# EAGLE schematic MCU (EAGLE 8.7.1)
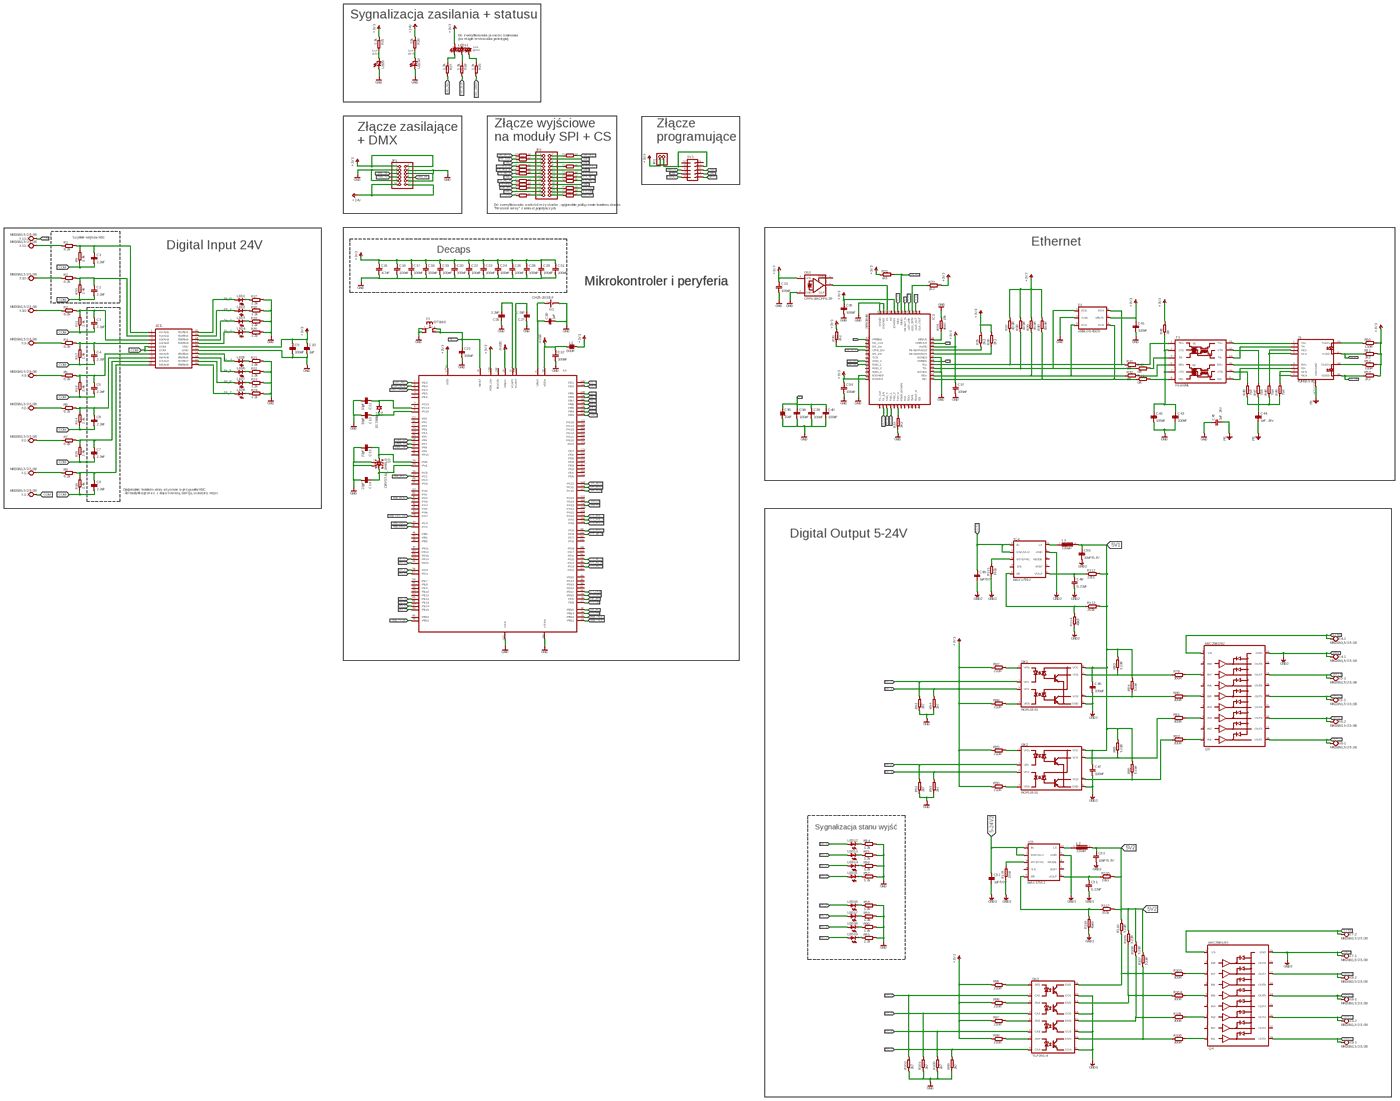
[diagram p0: schematic, sheet 1, overview]
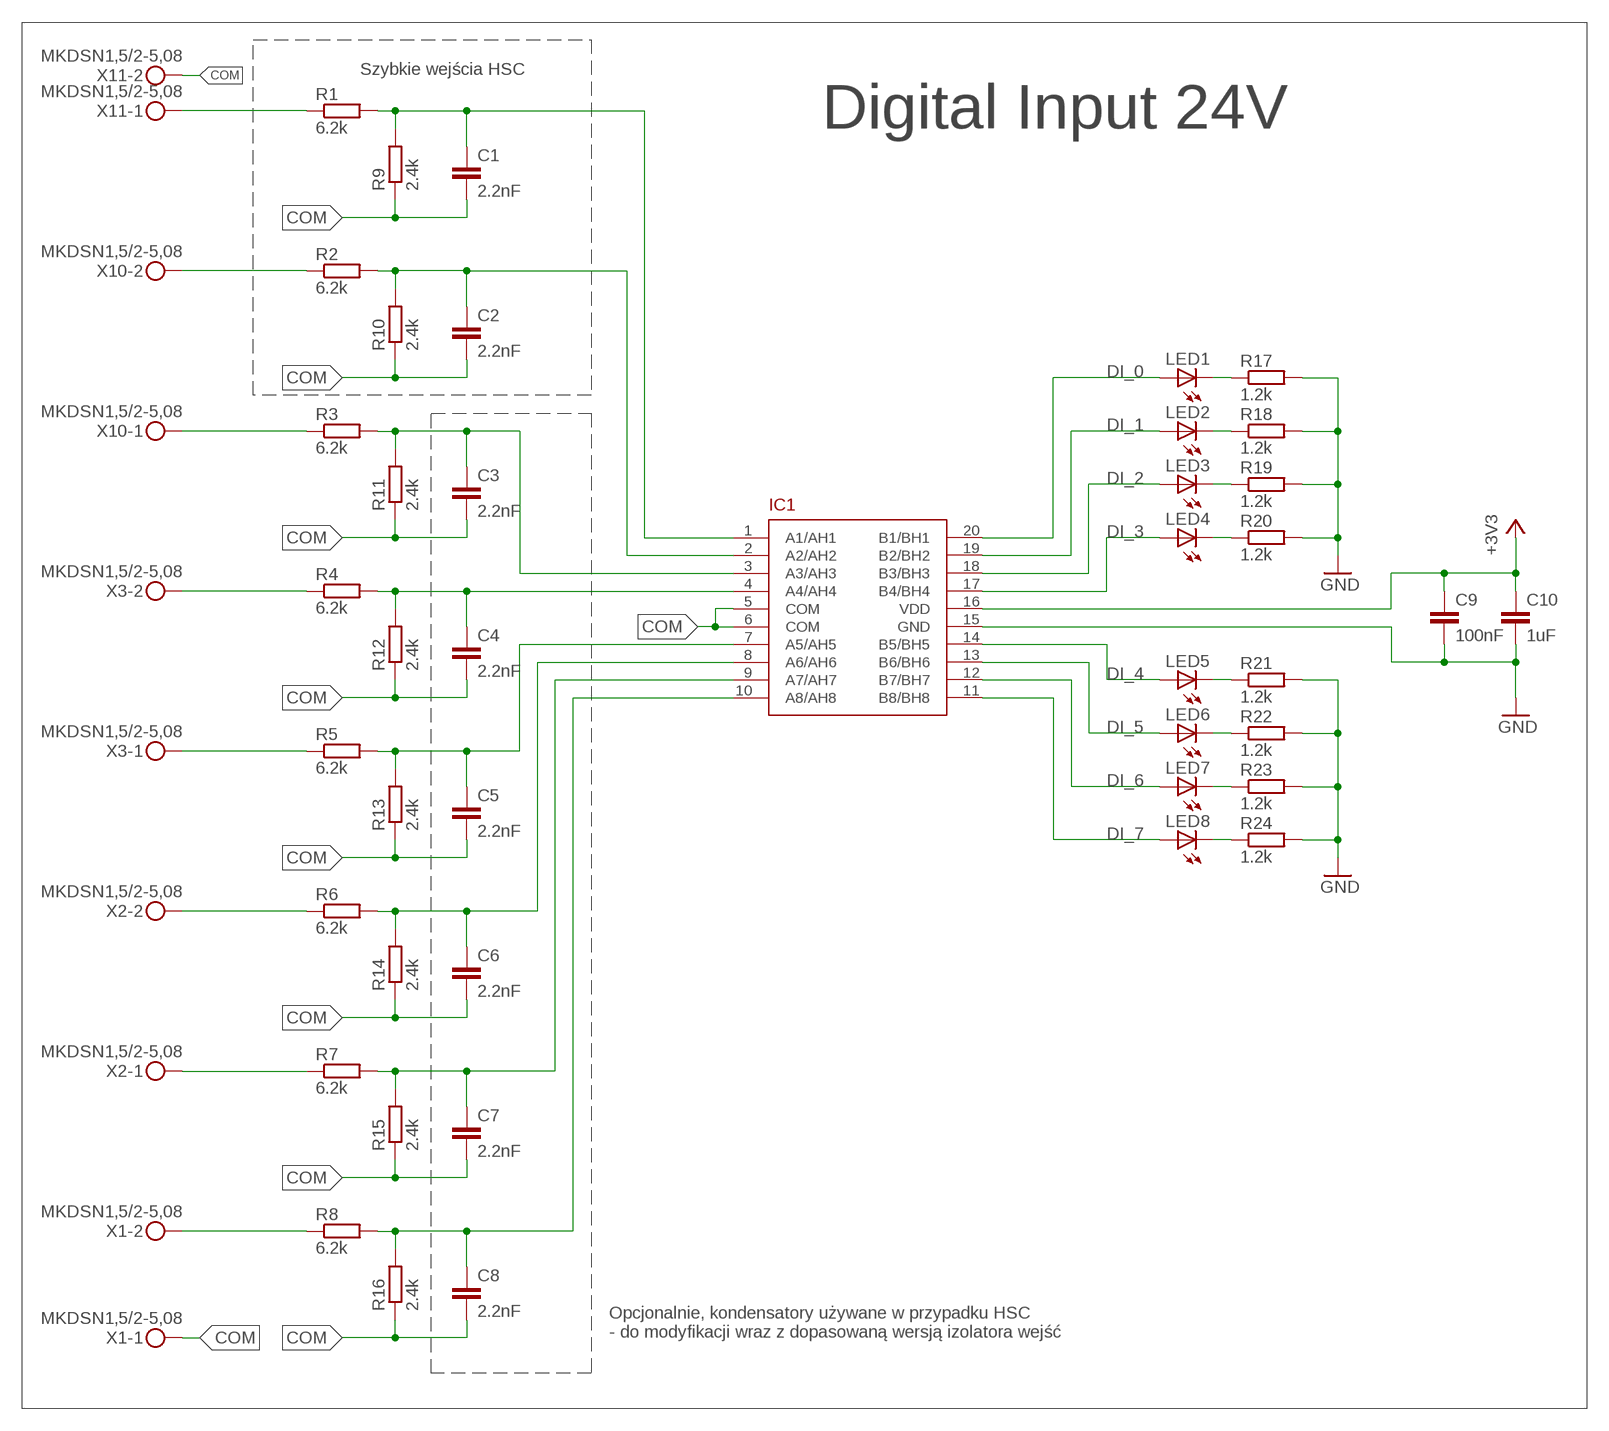
[diagram p1: schematic, sheet 1, part 1 of 5]
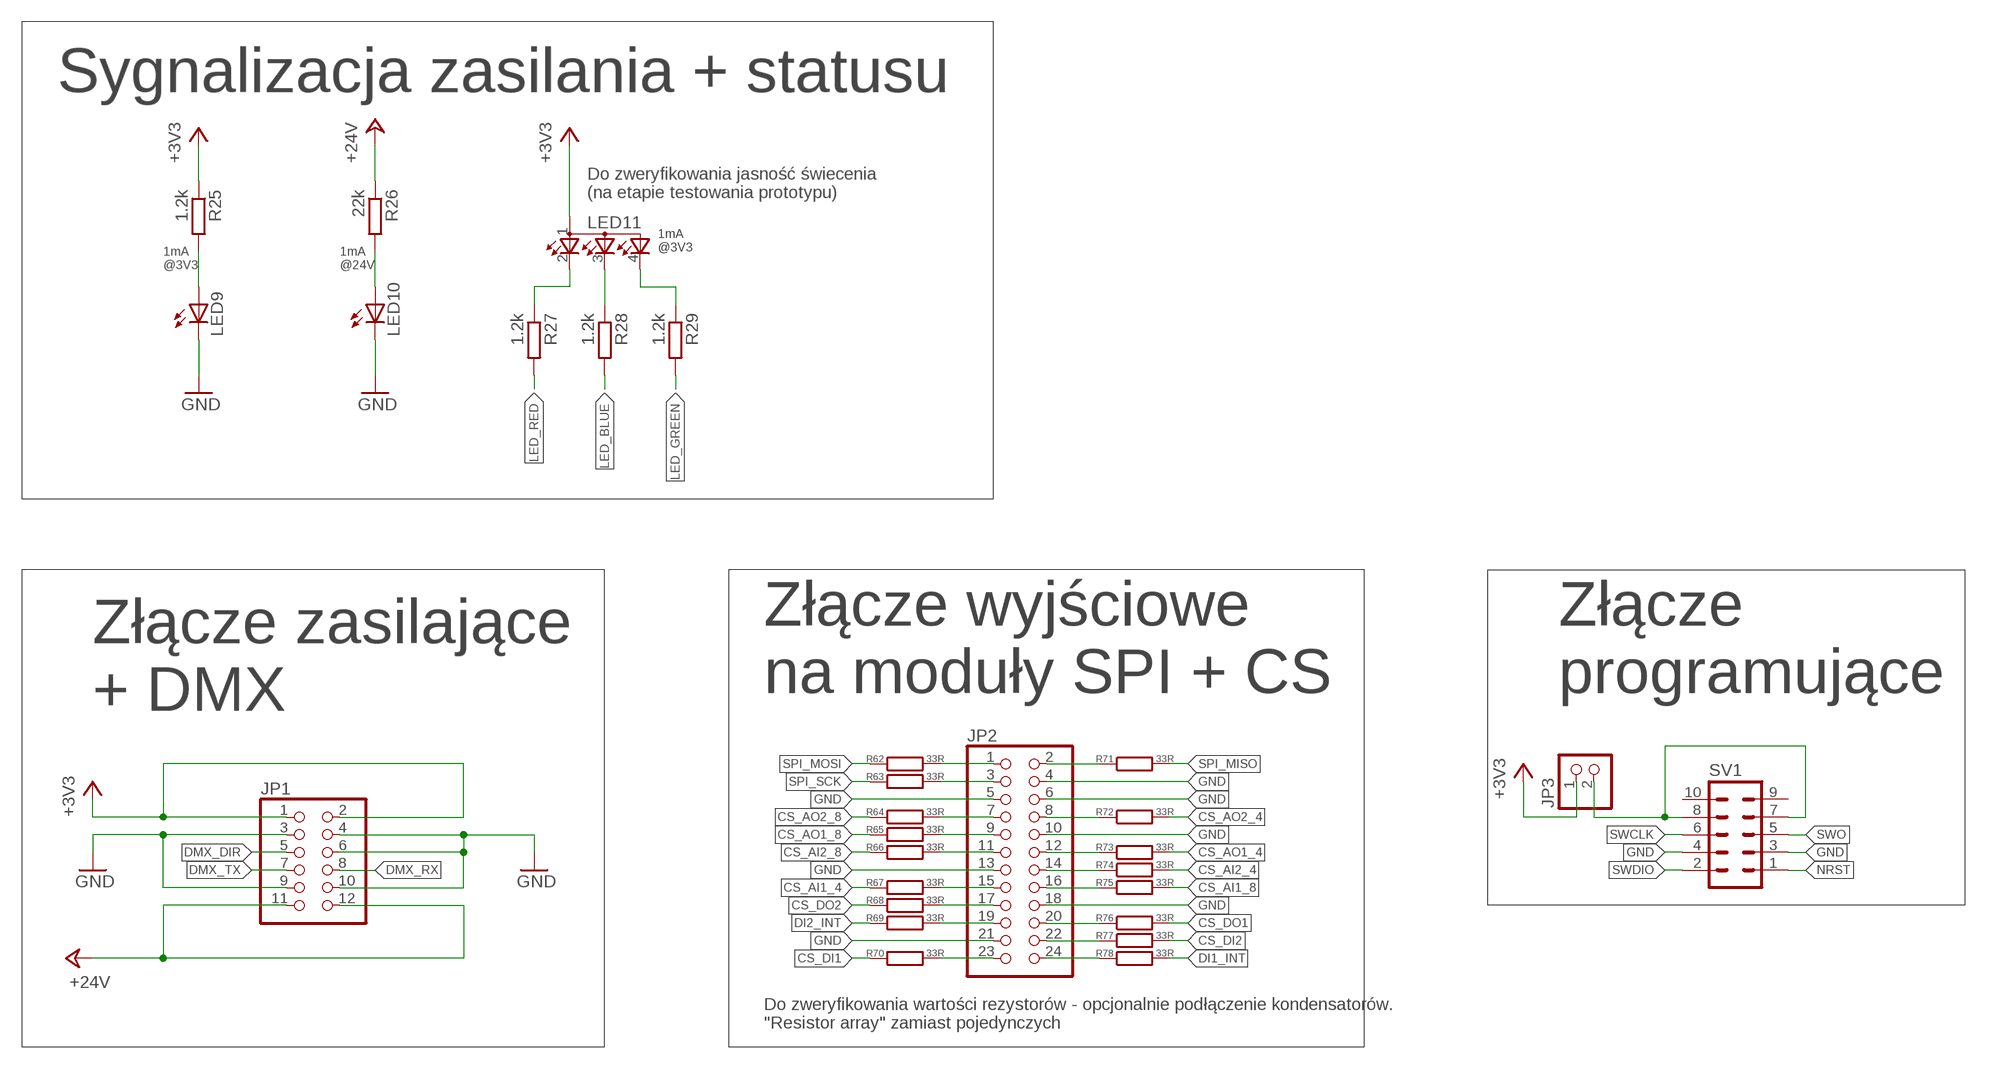
[diagram p2: schematic, sheet 1, part 2 of 5]
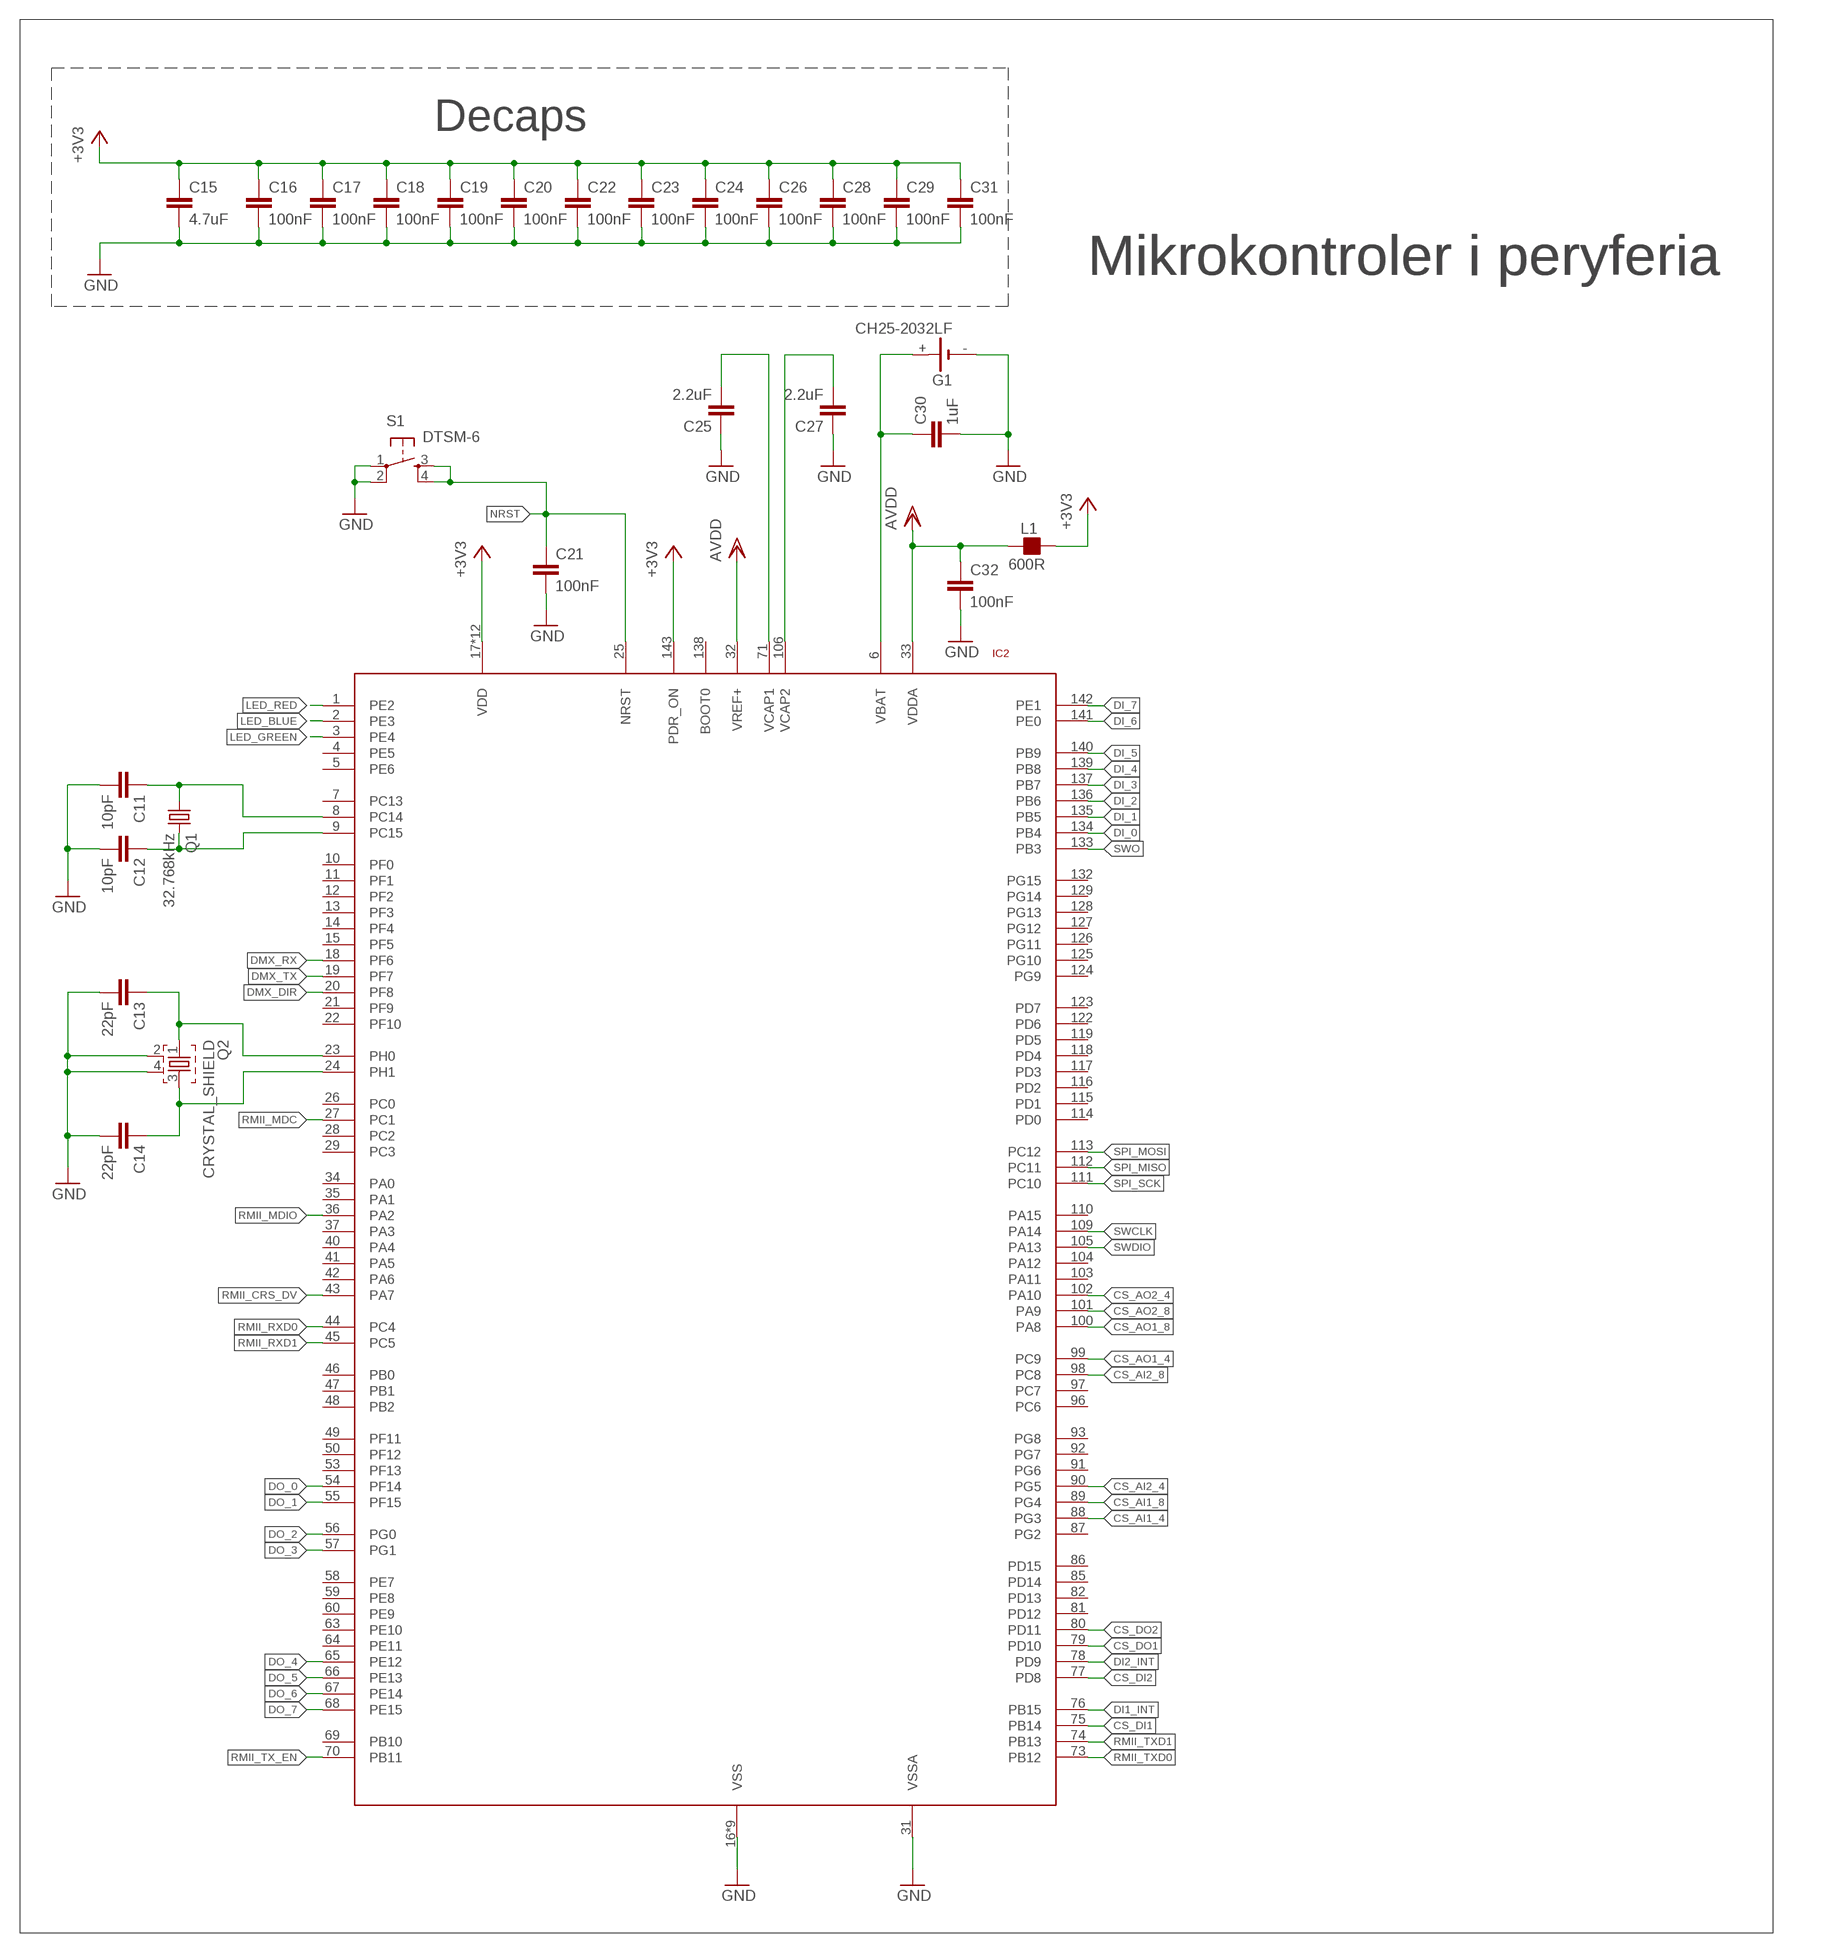
[diagram p3: schematic, sheet 1, part 3 of 5]
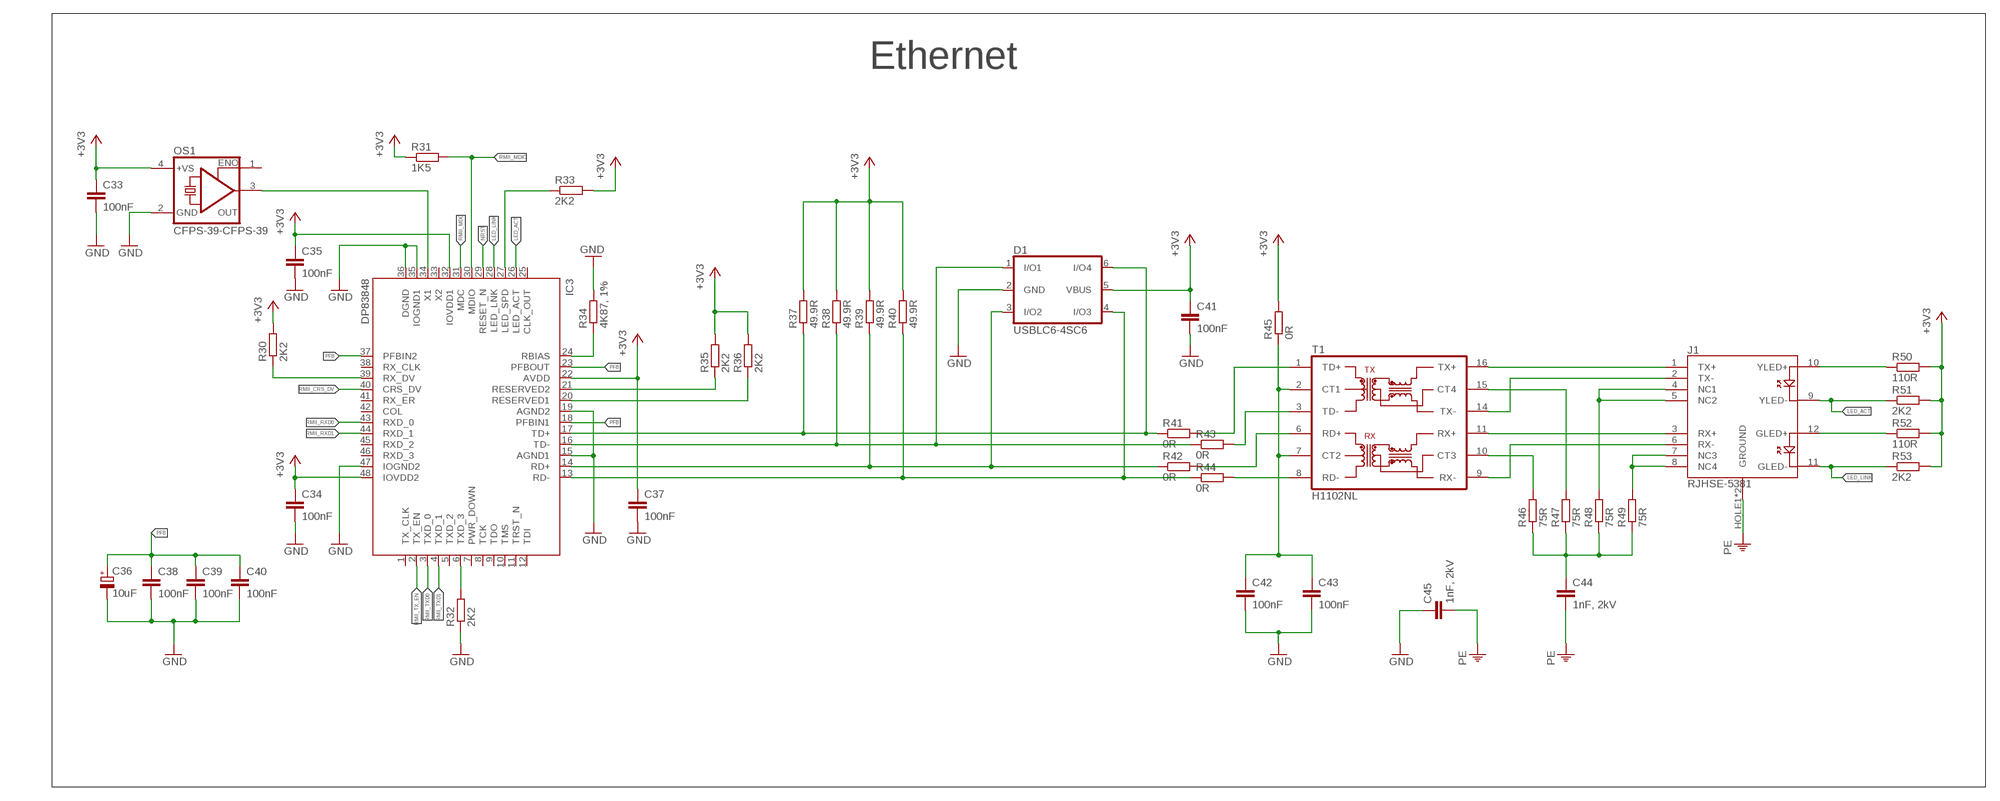
[diagram p4: schematic, sheet 1, part 4 of 5]
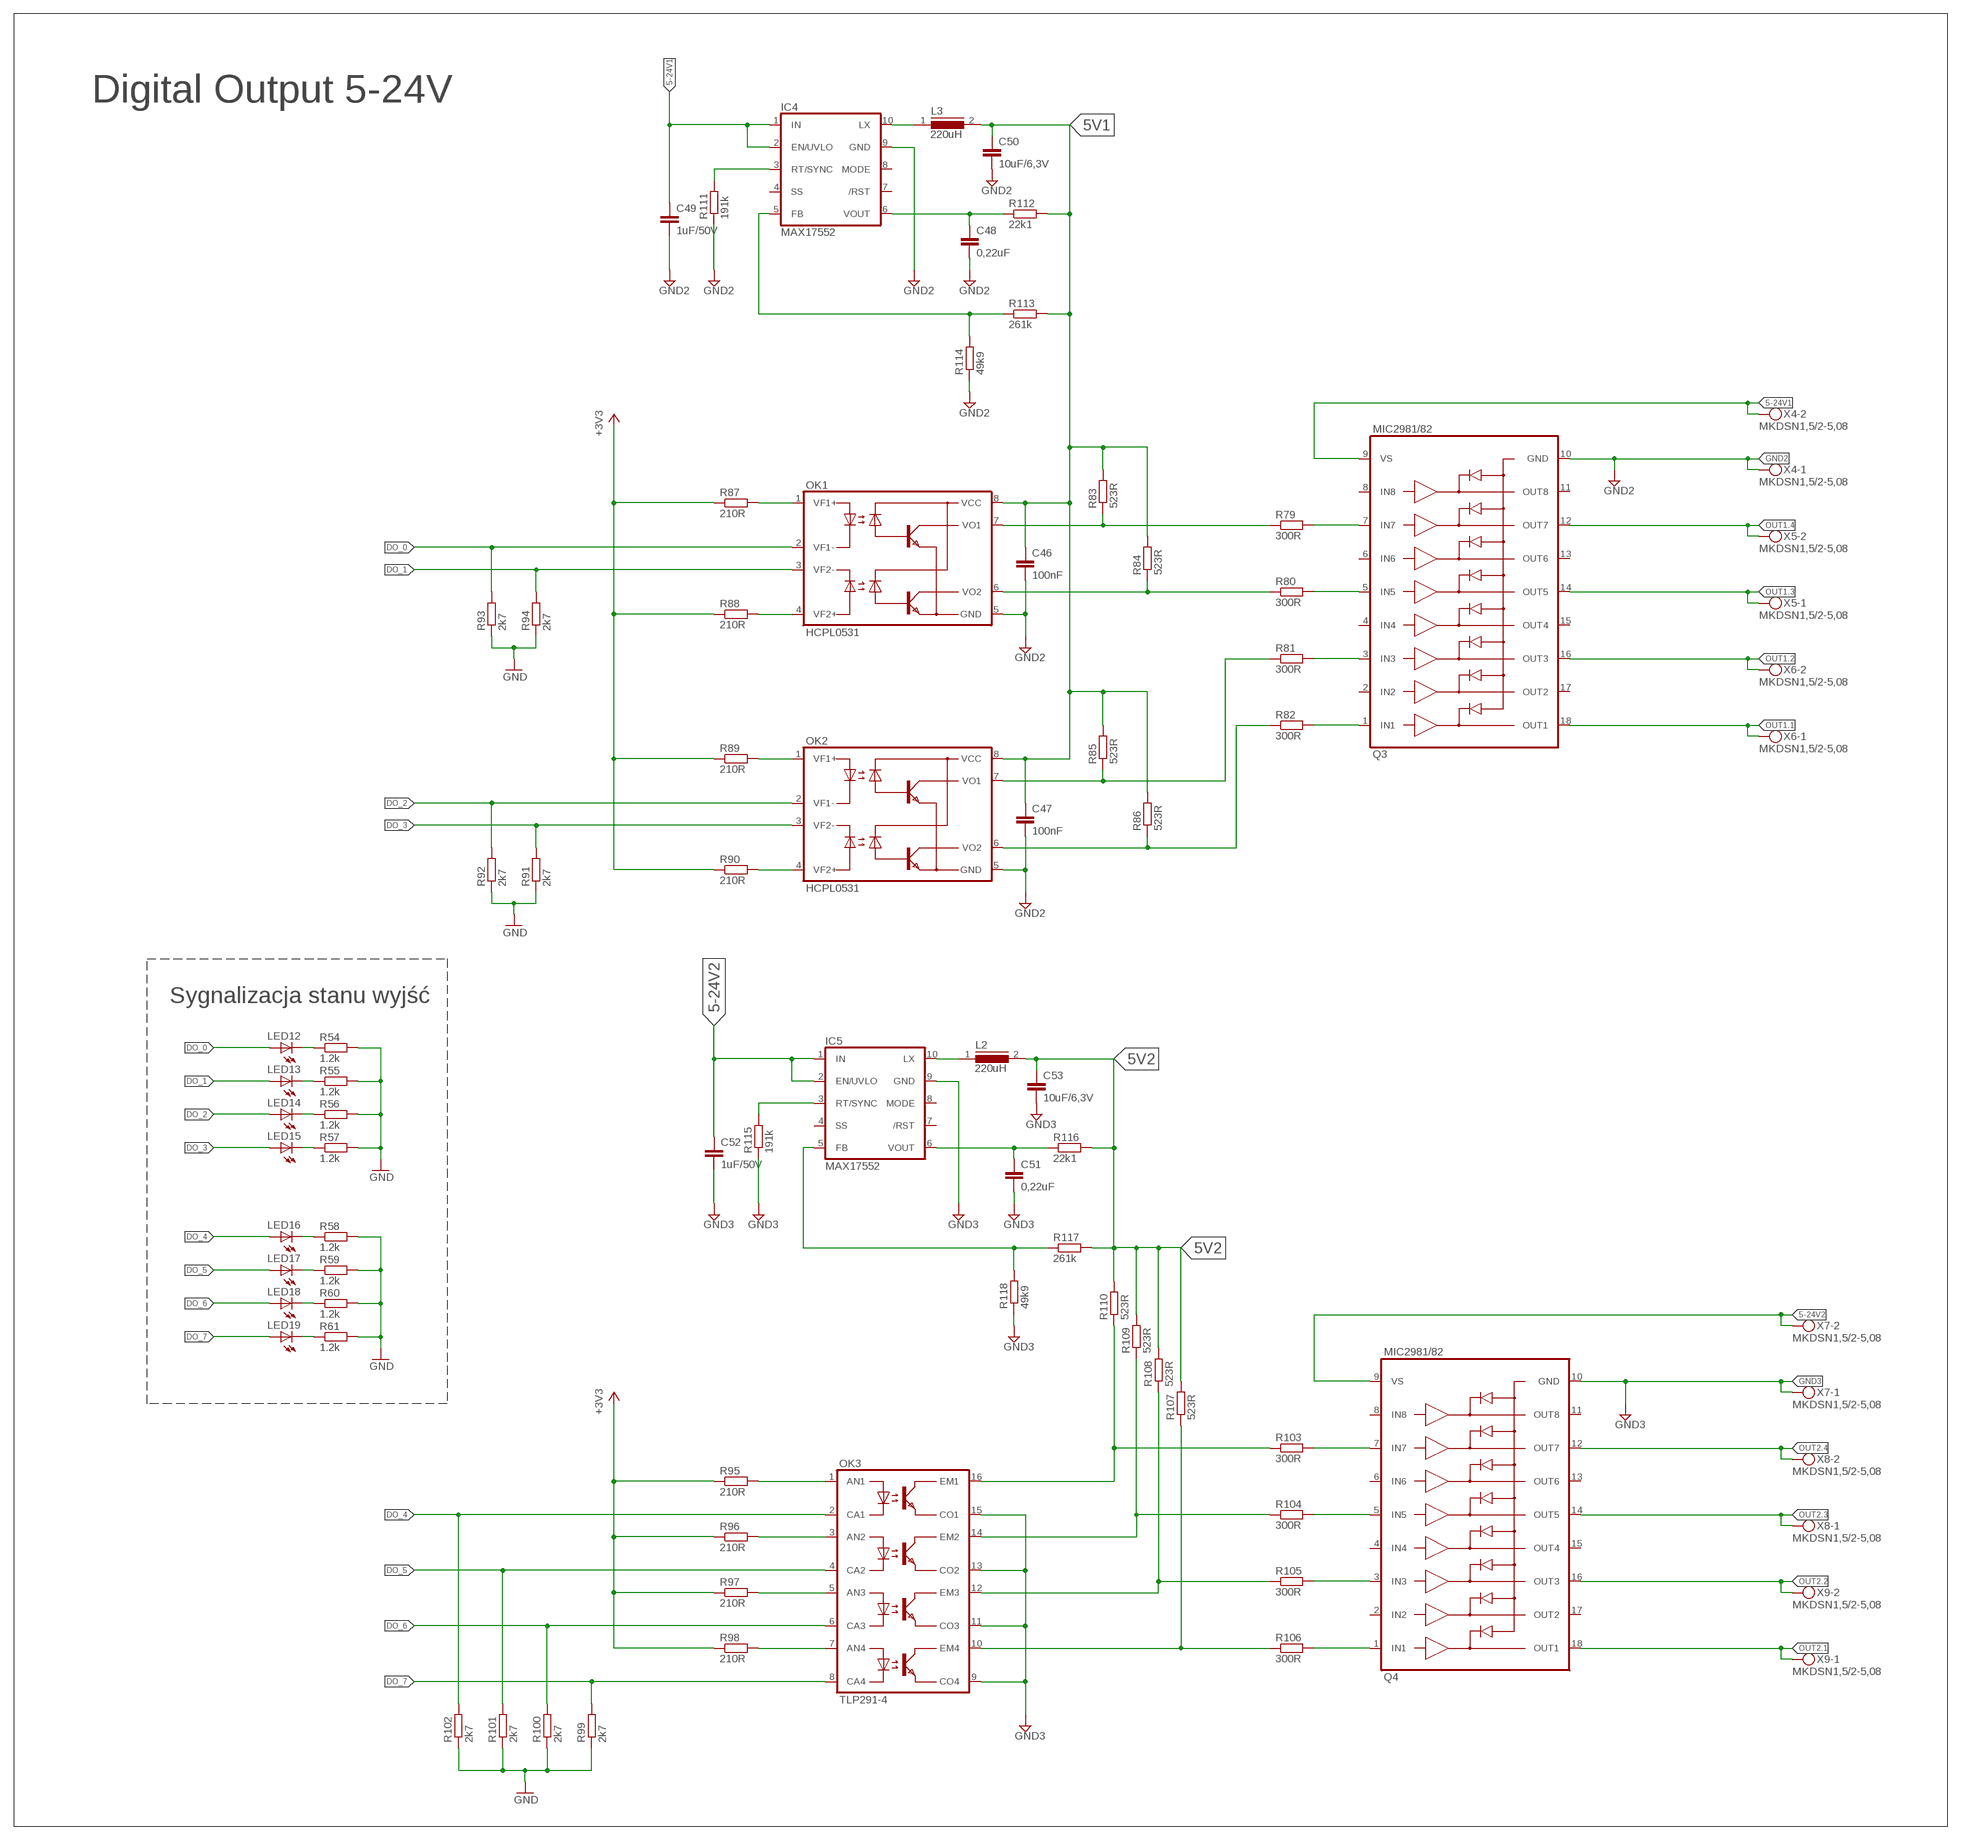
[diagram p5: schematic, sheet 1, part 5 of 5]

## Parts
C1  2.2nF  C-EUC0805  [C0805]
C2  2.2nF  C-EUC0805  [C0805]
C3  2.2nF  C-EUC0805  [C0805]
C4  2.2nF  C-EUC0805  [C0805]
C5  2.2nF  C-EUC0805  [C0805]
C6  2.2nF  C-EUC0805  [C0805]
C7  2.2nF  C-EUC0805  [C0805]
C8  2.2nF  C-EUC0805  [C0805]
C9  100nF  C-EUC0603K  [C0603K]
C10  1uF  C-EUC0603K  [C0603K]
C11  10pF  C-EUC0603K  [C0603K]
C12  10pF  C-EUC0603K  [C0603K]
C13  22pF  C-EUC0603K  [C0603K]
C14  22pF  C-EUC0603K  [C0603K]
C15  4.7uF  C-EUC0603K  [C0603K]
C16  100nF  C-EUC0603K  [C0603K]
C17  100nF  C-EUC0603K  [C0603K]
C18  100nF  C-EUC0603K  [C0603K]
C19  100nF  C-EUC0603K  [C0603K]
C20  100nF  C-EUC0603K  [C0603K]
C21  100nF  C-EUC0603K  [C0603K]
C22  100nF  C-EUC0603K  [C0603K]
C23  100nF  C-EUC0603K  [C0603K]
C24  100nF  C-EUC0603K  [C0603K]
C25  2.2uF  C-EUC0603K  [C0603K]
C26  100nF  C-EUC0603K  [C0603K]
C27  2.2uF  C-EUC0603K  [C0603K]
C28  100nF  C-EUC0603K  [C0603K]
C29  100nF  C-EUC0603K  [C0603K]
C30  1uF  C-EUC0603K  [C0603K]
C31  100nF  C-EUC0603K  [C0603K]
C32  100nF  C-EUC0603K  [C0603K]
C33  100nF  C-EUC0603  [C0603]
C34  100nF  C-EUC0603  [C0603]
C35  100nF  C-EUC0603  [C0603]
C36  10uF  CPOL-EUSMCA  [SMC_A]
C37  100nF  C-EUC0603  [C0603]
C38  100nF  C-EUC0603  [C0603]
C39  100nF  C-EUC0603  [C0603]
C40  100nF  C-EUC0603  [C0603]
C41  100nF  C-EUC0603  [C0603]
C42  100nF  C-EUC0603  [C0603]
C43  100nF  C-EUC0603  [C0603]
C44  1nF, 2kV  C-EUC1206  [C1206]
C45  1nF, 2kV  C-EUC1206  [C1206]
C46  100nF  C-EUC0603  [C0603]
C47  100nF  C-EUC0603  [C0603]
C48  0,22uF  C-EUC0603  [C0603]
C49  1uF/50V  C-EUC1206  [C1206]
C50  10uF/6,3V  C-EUC1206  [C1206]
C51  0,22uF  C-EUC0603  [C0603]
C52  1uF/50V  C-EUC1206  [C1206]
C53  10uF/6,3V  C-EUC1206  [C1206]
D1  USBLC6-4SC6  [SOT23-6]
G1  CH25-2032LF  [CH25-2032LF]
IC1  SI8382P-IU  SI838X  [QSOP-20]
IC2  STM32F429ZILQFP144  [LQFP144]
IC3  DP83848  [LQFP48]
IC4  MAX17552  [TSSOP-10(10UMAX)]
IC5  MAX17552  [TSSOP-10(10UMAX)]
J1  RJHSE-5381  [MAGJACK-19938]
JP1  PINHD-2X6  [2X06]
JP2  PINHD-2X12  [2X12]
JP3  PINHD-1X2  [1X02]
L1  600R  FB_0603  [L0603]
L2  220uH  SRR4528A221M  [SRR4528A]
L3  220uH  SRR4528A221M  [SRR4528A]
LED1  LEDCHIP-LED0603  [CHIP-LED0603]
LED2  LEDCHIP-LED0603  [CHIP-LED0603]
LED3  LEDCHIP-LED0603  [CHIP-LED0603]
LED4  LEDCHIP-LED0603  [CHIP-LED0603]
LED5  LEDCHIP-LED0603  [CHIP-LED0603]
LED6  LEDCHIP-LED0603  [CHIP-LED0603]
LED7  LEDCHIP-LED0603  [CHIP-LED0603]
LED8  LEDCHIP-LED0603  [CHIP-LED0603]
LED9  LEDCHIP-LED0603  [CHIP-LED0603]
LED10  LEDCHIP-LED0603  [CHIP-LED0603]
LED11  APHF1608SEEQBDZGKC  [APHF1608SEEQBDZGKC]
LED12  LEDCHIP-LED0603  [CHIP-LED0603]
LED13  LEDCHIP-LED0603  [CHIP-LED0603]
LED14  LEDCHIP-LED0603  [CHIP-LED0603]
LED15  LEDCHIP-LED0603  [CHIP-LED0603]
LED16  LEDCHIP-LED0603  [CHIP-LED0603]
LED17  LEDCHIP-LED0603  [CHIP-LED0603]
LED18  LEDCHIP-LED0603  [CHIP-LED0603]
LED19  LEDCHIP-LED0603  [CHIP-LED0603]
OK1  HCPL0531  [SOIC08]
OK2  HCPL0531  [SOIC08]
OK3  TLP291-4  [SO16]
OS1  CFPS-39-CFPS-39  [3.4X2.7-4-PAD]
Q1  32.768kHz  CRYSTAL3.5X1.5  [CRYSTAL_3.5X1.5]
Q2  CRYSTAL_SHIELD  [CRYSTAL_5X3.2]
Q3  MIC2981/82  [SOP18]
Q4  MIC2981/82  [SOP18]
R1  6.2k  R-EU_R1206  [R1206]
R2  6.2k  R-EU_R1206  [R1206]
R3  6.2k  R-EU_R1206  [R1206]
R4  6.2k  R-EU_R1206  [R1206]
R5  6.2k  R-EU_R1206  [R1206]
R6  6.2k  R-EU_R1206  [R1206]
R7  6.2k  R-EU_R1206  [R1206]
R8  6.2k  R-EU_R1206  [R1206]
R9  2.4k  R-EU_R1206  [R1206]
R10  2.4k  R-EU_R1206  [R1206]
R11  2.4k  R-EU_R1206  [R1206]
R12  2.4k  R-EU_R1206  [R1206]
R13  2.4k  R-EU_R1206  [R1206]
R14  2.4k  R-EU_R1206  [R1206]
R15  2.4k  R-EU_R1206  [R1206]
R16  2.4k  R-EU_R1206  [R1206]
R17  1.2k  R-EU_R0603  [R0603]
R18  1.2k  R-EU_R0603  [R0603]
R19  1.2k  R-EU_R0603  [R0603]
R20  1.2k  R-EU_R0603  [R0603]
R21  1.2k  R-EU_R0603  [R0603]
R22  1.2k  R-EU_R0603  [R0603]
R23  1.2k  R-EU_R0603  [R0603]
R24  1.2k  R-EU_R0603  [R0603]
R25  1.2k  R-EU_R0603  [R0603]
R26  22k  R-EU_R0603  [R0603]
R27  1.2k  R-EU_R0603  [R0603]
R28  1.2k  R-EU_R0603  [R0603]
R29  1.2k  R-EU_R0603  [R0603]
R30  2K2  R-EU_R0603  [R0603]
R31  1K5  R-EU_R0603  [R0603]
R32  2K2  R-EU_R0603  [R0603]
R33  2K2  R-EU_R0603  [R0603]
R34  4K87, 1%  R-EU_R0603  [R0603]
R35  2K2  R-EU_R0603  [R0603]
R36  2K2  R-EU_R0603  [R0603]
R37  49.9R  R-EU_R0603  [R0603]
R38  49.9R  R-EU_R0603  [R0603]
R39  49.9R  R-EU_R0603  [R0603]
R40  49.9R  R-EU_R0603  [R0603]
R41  0R  R-EU_R0603  [R0603]
R42  0R  R-EU_R0603  [R0603]
R43  0R  R-EU_R0603  [R0603]
R44  0R  R-EU_R0603  [R0603]
R45  0R  R-EU_R0603  [R0603]
R46  75R  R-EU_R0603  [R0603]
R47  75R  R-EU_R0603  [R0603]
R48  75R  R-EU_R0603  [R0603]
R49  75R  R-EU_R0603  [R0603]
R50  110R  R-EU_R0603  [R0603]
R51  2K2  R-EU_R0603  [R0603]
R52  110R  R-EU_R0603  [R0603]
R53  2K2  R-EU_R0603  [R0603]
R54  1.2k  R-EU_R0603  [R0603]
R55  1.2k  R-EU_R0603  [R0603]
R56  1.2k  R-EU_R0603  [R0603]
R57  1.2k  R-EU_R0603  [R0603]
R58  1.2k  R-EU_R0603  [R0603]
R59  1.2k  R-EU_R0603  [R0603]
R60  1.2k  R-EU_R0603  [R0603]
R61  1.2k  R-EU_R0603  [R0603]
R62  33R  R-EU_R0603  [R0603]
R63  33R  R-EU_R0603  [R0603]
R64  33R  R-EU_R0603  [R0603]
R65  33R  R-EU_R0603  [R0603]
R66  33R  R-EU_R0603  [R0603]
R67  33R  R-EU_R0603  [R0603]
R68  33R  R-EU_R0603  [R0603]
R69  33R  R-EU_R0603  [R0603]
R70  33R  R-EU_R0603  [R0603]
R71  33R  R-EU_R0603  [R0603]
R72  33R  R-EU_R0603  [R0603]
R73  33R  R-EU_R0603  [R0603]
R74  33R  R-EU_R0603  [R0603]
R75  33R  R-EU_R0603  [R0603]
R76  33R  R-EU_R0603  [R0603]
R77  33R  R-EU_R0603  [R0603]
R78  33R  R-EU_R0603  [R0603]
R79  300R  R-EU_R0603  [R0603]
R80  300R  R-EU_R0603  [R0603]
R81  300R  R-EU_R0603  [R0603]
R82  300R  R-EU_R0603  [R0603]
R83  523R  R-EU_R0603  [R0603]
R84  523R  R-EU_R0603  [R0603]
R85  523R  R-EU_R0603  [R0603]
R86  523R  R-EU_R0603  [R0603]
R87  210R  R-EU_R0603  [R0603]
R88  210R  R-EU_R0603  [R0603]
R89  210R  R-EU_R0603  [R0603]
R90  210R  R-EU_R0603  [R0603]
R91  2k7  R-EU_R0603  [R0603]
R92  2k7  R-EU_R0603  [R0603]
R93  2k7  R-EU_R0603  [R0603]
R94  2k7  R-EU_R0603  [R0603]
R95  210R  R-EU_R0603  [R0603]
R96  210R  R-EU_R0603  [R0603]
R97  210R  R-EU_R0603  [R0603]
R98  210R  R-EU_R0603  [R0603]
R99  2k7  R-EU_R0603  [R0603]
R100  2k7  R-EU_R0603  [R0603]
R101  2k7  R-EU_R0603  [R0603]
R102  2k7  R-EU_R0603  [R0603]
R103  300R  R-EU_R0603  [R0603]
R104  300R  R-EU_R0603  [R0603]
R105  300R  R-EU_R0603  [R0603]
R106  300R  R-EU_R0603  [R0603]
R107  523R  R-EU_R0603  [R0603]
R108  523R  R-EU_R0603  [R0603]
R109  523R  R-EU_R0603  [R0603]
R110  523R  R-EU_R0603  [R0603]
R111  191k  R-EU_R0603  [R0603]
R112  22k1  R-EU_R0603  [R0603]
R113  261k  R-EU_R0603  [R0603]
R114  49k9  R-EU_R0603  [R0603]
R115  191k  R-EU_R0603  [R0603]
R116  22k1  R-EU_R0603  [R0603]
R117  261k  R-EU_R0603  [R0603]
R118  49k9  R-EU_R0603  [R0603]
S1  DTSM-6  [DTSM-6]
SV1  ML10  [ML10]
T1  H1102NL  HX1188  [HXXXX]
X1  MKDSN1,5/2-5,08  [MKDSN1,5/2-5,08]
X2  MKDSN1,5/2-5,08  [MKDSN1,5/2-5,08]
X3  MKDSN1,5/2-5,08  [MKDSN1,5/2-5,08]
X4  MKDSN1,5/2-5,08  [MKDSN1,5/2-5,08]
X5  MKDSN1,5/2-5,08  [MKDSN1,5/2-5,08]
X6  MKDSN1,5/2-5,08  [MKDSN1,5/2-5,08]
X7  MKDSN1,5/2-5,08  [MKDSN1,5/2-5,08]
X8  MKDSN1,5/2-5,08  [MKDSN1,5/2-5,08]
X9  MKDSN1,5/2-5,08  [MKDSN1,5/2-5,08]
X10  MKDSN1,5/2-5,08  [MKDSN1,5/2-5,08]
X11  MKDSN1,5/2-5,08  [MKDSN1,5/2-5,08]

## Nets
5-24V1: C49.1 IC4.1(IN) IC4.2(EN/UVLO) Q3.9(VS) X4.2
5-24V2: C52.1 IC5.1(IN) IC5.2(EN/UVLO) Q4.9(VS) X7.2
5V1: C46.1 C47.1 C50.1 L3.2 OK1.8(VCC) OK2.8(VCC) R83.2 R84.2 R85.2 R86.2 R112.2 R113.2
5V2: C53.1 L2.2 R107.2 R108.2 R109.2 R110.2 R116.2 R117.2
+3V3: C9.1 C10.1 C15.1 C16.1 C17.1 C18.1 C19.1 C20.1 C22.1 C23.1 C24.1 C26.1 C28.1 C29.1 C31.1 C33.1 C34.1 C35.1 C37.1 C41.1 D1.5(VBUS) IC1.16(VDD) IC2.17(VDD) IC2.30(VDD) IC2.39(VDD) IC2.52(VDD) IC2.62(VDD) IC2.72(VDD) IC2.84(VDD) IC2.95(VDD) IC2.108(VDD) IC2.121(VDD) IC2.131(VDD) IC2.143(PDR_ON) IC2.144(VDD) IC3.22(AVDD) IC3.32(IOVDD1) IC3.48(IOVDD2) JP1.1 JP1.2 JP3.1 L1.2 LED11.1(A) OS1.4(VDD) R25.1 R30.2 R31.1 R33.2 R35.2 R36.2 R37.2 R38.2 R39.2 R40.2 R45.2 R50.2 R51.2 R52.2 R53.2 R87.1 R88.1 R89.1 R90.1 R95.1 R96.1 R97.1 R98.1
+24V: JP1.11 JP1.12 R26.1
COM: C1.2 C2.2 C3.2 C4.2 C5.2 C6.2 C7.2 C8.2 IC1.5(COM) IC1.6(COM) R9.1 R10.1 R11.1 R12.1 R13.1 R14.1 R15.1 R16.1 X1.1 X11.2
CS_AI1_4: IC2.88(PG3) R67.1
CS_AI1_8: IC2.89(PG4) R75.2
CS_AI2_4: IC2.90(PG5) R74.2
CS_AI2_8: IC2.98(PC8) R66.1
CS_AO1_4: IC2.99(PC9) R73.2
CS_AO1_8: IC2.100(PA8) R65.1
CS_AO2_4: IC2.102(PA10) R72.2
CS_AO2_8: IC2.101(PA9) R64.1
CS_DI1: IC2.75(PB14) R70.1
CS_DI2: IC2.77(PD8) R77.2
CS_DO1: IC2.79(PD10) R76.2
CS_DO2: IC2.80(PD11) R68.1
DI1_INT: IC2.76(PB15) R78.2
DI2_INT: IC2.78(PD9) R69.1
DI_0: IC1.20(B1/BH1) IC2.134(PB4) LED1.A
DI_1: IC1.19(B2/BH2) IC2.135(PB5) LED2.A
DI_2: IC1.18(B3/BH3) IC2.136(PB6) LED3.A
DI_3: IC1.17(B4/BH4) IC2.137(PB7) LED4.A
DI_4: IC1.14(B5/BH5) IC2.139(PB8) LED5.A
DI_5: IC1.13(B6/BH6) IC2.140(PB9) LED6.A
DI_6: IC1.12(B7/BH7) IC2.141(PE0) LED7.A
DI_7: IC1.11(B8/BH8) IC2.142(PE1) LED8.A
DMX_DIR: IC2.20(PF8) JP1.5
DMX_RX: IC2.18(PF6) JP1.8
DMX_TX: IC2.19(PF7) JP1.7
DO_0: IC2.54(PF14) LED12.A OK1.2(VF1-) R93.2
DO_1: IC2.55(PF15) LED13.A OK1.3(VF2-) R94.2
DO_2: IC2.56(PG0) LED14.A OK2.2(VF1-) R92.2
DO_3: IC2.57(PG1) LED15.A OK2.3(VF2-) R91.2
DO_4: IC2.65(PE12) LED16.A OK3.2(CA1) R102.2
DO_5: IC2.66(PE13) LED17.A OK3.4(CA2) R101.2
DO_6: IC2.67(PE14) LED18.A OK3.6(CA3) R100.2
DO_7: IC2.68(PE15) LED19.A OK3.8(CA4) R99.2
GND: C9.2 C10.2 C11.2 C12.2 C13.2 C14.2 C15.2 C16.2 C17.2 C18.2 C19.2 C20.2 C21.2 C22.2 C23.2 C24.2 C25.1 C26.2 C27.1 C28.2 C29.2 C30.2 C31.2 C32.2 C33.2 C34.2 C35.2 C36.- C37.2 C38.2 C39.2 C40.2 C41.2 C42.2 C43.2 C45.1 D1.2(GND) G1.- IC1.15(GND) IC2.16(VSS) IC2.31(VSSA) IC2.38(VSS) IC2.51(VSS) IC2.61(VSS) IC2.83(VSS) IC2.94(VSS) IC2.107(VSS) IC2.120(VSS) IC2.130(VSS) IC3.15(AGND1) IC3.19(AGND2) IC3.35(IOGND1) IC3.36(DGND) IC3.47(IOGND2) JP1.3 JP1.4 JP1.6 JP1.9 JP1.10 JP2.4 JP2.5 JP2.6 JP2.10 JP2.13 JP2.18 JP2.21 LED9.C LED10.C OS1.2(VSS) Q2.2 Q2.4 R17.2 R18.2 R19.2 R20.2 R21.2 R22.2 R23.2 R24.2 R32.1 R34.2 R54.2 R55.2 R56.2 R57.2 R58.2 R59.2 R60.2 R61.2 R91.1 R92.1 R93.1 R94.1 R99.1 R100.1 R101.1 R102.1 S1.1 S1.2 SV1.3 SV1.4
GND2: C46.2 C47.2 C48.2 C49.2 C50.2 IC4.9(GND) OK1.5(GND) OK2.5(GND) Q3.10(GND) R111.1 R114.1 X4.1
GND3: C51.2 C52.2 C53.2 IC5.9(GND) OK3.9(CO4) OK3.11(CO3) OK3.13(CO2) OK3.15(CO1) Q4.10(GND) R115.1 R118.1 X7.1
LED_ACT: IC3.26(LED_ACT) J1.9(YLED-) R51.1
LED_BLUE: IC2.2(PE3) R28.2
LED_GREEN: IC2.3(PE4) R29.2
LED_LINK: IC3.28(LED_LNK) J1.11(GLED-) R53.1
LED_RED: IC2.1(PE2) R27.2
N$1: LED11.2(CRED) R27.1
N$2: C25.2 IC2.71(VCAP1)
N$3: C27.2 IC2.106(VCAP2)
N$4: C11.1 IC2.8(PC14) Q1.1
N$5: C12.1 IC2.9(PC15) Q1.2
N$6: LED12.C R54.1
N$7: C13.1 IC2.23(PH0) Q2.1
N$8: C14.1 IC2.24(PH1) Q2.3
N$9: C1.1 IC1.1(A1/AH1) R1.2 R9.2
N$10: LED11.3(CBLUE) R28.1
N$11: LED1.C R17.1
N$12: C2.1 IC1.2(A2/AH2) R2.2 R10.2
N$13: LED2.C R18.1
N$14: LED3.C R19.1
N$15: R1.1 X11.1
N$16: LED11.4(CGREEN) R29.1
N$17: LED4.C R20.1
N$18: R2.1 X10.2
N$19: C3.1 IC1.3(A3/AH3) R3.2 R11.2
N$20: R3.1 X10.1
N$21: C4.1 IC1.4(A4/AH4) R4.2 R12.2
N$22: R4.1 X3.2
N$23: C5.1 IC1.7(A5/AH5) R5.2 R13.2
N$24: R5.1 X3.1
N$25: C6.1 IC1.8(A6/AH6) R6.2 R14.2
N$26: R6.1 X2.2
N$27: C7.1 IC1.9(A7/AH7) R7.2 R15.2
N$28: R7.1 X2.1
N$29: C8.1 IC1.10(A8/AH8) R8.2 R16.2
N$30: R8.1 X1.2
N$31: LED10.A R26.2
N$32: LED5.C R21.1
N$33: LED6.C R22.1
N$34: LED7.C R23.1
N$35: LED8.C R24.1
N$36: LED13.C R55.1
N$37: LED14.C R56.1
N$38: LED15.C R57.1
N$39: J1.4(NC1) J1.5(NC2) R48.2
N$40: J1.7(NC3) J1.8(NC4) R49.2
N$41: R47.2 T1.15(CT4)
N$42: LED9.A R25.2
N$43: R46.2 T1.10(CT3)
N$44: C44.1 R46.1 R47.1 R48.1 R49.1
N$45: J1.12(GLED+) R52.1
N$46: J1.10(YLED+) R50.1
N$47: LED16.C R58.1
N$48: LED17.C R59.1
N$49: LED18.C R60.1
N$50: LED19.C R61.1
N$51: C42.1 C43.1 R45.1 T1.2(CT1) T1.7(CT2)
N$52: IC3.21(RESERVED2) R35.1
N$53: IC3.20(RESERVED1) R36.1
N$54: IC3.24(RBIAS) R34.1
N$55: R41.2 T1.1(TD+)
N$56: R43.2 T1.3(TD-)
N$57: R42.2 T1.6(RD+)
N$58: R44.2 T1.8(RD-)
N$59: IC3.34(X1) OS1.3(OUT)
N$60: IC3.27(LED_SPD) R33.1
N$61: IC3.39(RX_DV) R30.1
N$62: IC3.6(TXD_3) R32.2
N$63: JP3.2 SV1.7 SV1.8
N$64: JP2.2 R71.1
N$65: JP2.8 R72.1
N$66: JP2.12 R73.1
N$67: JP2.14 R74.1
N$68: JP2.16 R75.1
N$69: JP2.20 R76.1
N$70: JP2.22 R77.1
N$71: JP2.3 R63.2
N$72: JP2.1 R62.2
N$73: JP2.7 R64.2
N$74: JP2.9 R65.2
N$75: JP2.11 R66.2
N$76: JP2.15 R67.2
N$77: JP2.17 R68.2
N$78: JP2.19 R69.2
N$79: JP2.23 R70.2
N$80: JP2.24 R78.1
N$81: OK1.7(VO1) R79.1 R83.1
N$82: Q3.7(IN7) R79.2
N$83: OK1.6(VO2) R80.1 R84.1
N$84: OK2.7(VO1) R81.1 R85.1
N$85: OK2.6(VO2) R82.1 R86.1
N$86: Q3.5(IN5) R80.2
N$87: Q3.3(IN3) R81.2
N$88: Q3.1(IN1) R82.2
N$89: OK1.1(VF1+) R87.2
N$90: OK1.4(VF2+) R88.2
N$91: OK2.1(VF1+) R89.2
N$92: OK2.4(VF2+) R90.2
N$93: OK3.1(AN1) R95.2
N$94: OK3.3(AN2) R96.2
N$95: OK3.5(AN3) R97.2
N$96: OK3.7(AN4) R98.2
N$97: Q4.7(IN7) R103.2
N$98: Q4.5(IN5) R104.2
N$99: Q4.3(IN3) R105.2
N$100: Q4.1(IN1) R106.2
N$101: OK3.12(EM3) R105.1 R108.1
N$102: OK3.14(EM2) R104.1 R109.1
N$103: OK3.16(EM1) R103.1 R110.1
N$104: OK3.10(EM4) R106.1 R107.1
N$105: IC4.3(RT/SYNC) R111.2
N$106: IC4.10(LX) L3.1
N$107: IC4.5(FB) R113.1 R114.2
N$108: C48.1 IC4.6(VOUT) R112.1
N$109: IC5.3(RT/SYNC) R115.2
N$110: IC5.10(LX) L2.1
N$111: IC5.5(FB) R117.1 R118.2
N$112: C51.1 IC5.6(VOUT) R116.1
NRST: C21.1 IC2.25(NRST) IC3.29(RESET_N) S1.3 S1.4 SV1.1
OUT1.1: Q3.18(OUT1) X6.1
OUT1.2: Q3.16(OUT3) X6.2
OUT1.3: Q3.14(OUT5) X5.1
OUT1.4: Q3.12(OUT7) X5.2
OUT2.1: Q4.18(OUT1) X9.1
OUT2.2: Q4.16(OUT3) X9.2
OUT2.3: Q4.14(OUT5) X8.1
OUT2.4: Q4.12(OUT7) X8.2
PE: C44.2 C45.2 J1.HOLE1(GROUND) J1.HOLE2(GROUND)
PFB: C36.+ C38.1 C39.1 C40.1 IC3.18(PFBIN1) IC3.23(PFBOUT) IC3.37(PFBIN2)
RD_N [diff pair]: D1.4(I/O3) IC3.13(RD-) R40.1 R44.1
RD_P [diff pair]: D1.3(I/O2) IC3.14(RD+) R39.1 R42.1
RMII_CRS_DV: IC2.43(PA7) IC3.40(CRS_DV)
RMII_MDC: IC2.27(PC1) IC3.31(MDC)
RMII_MDIO: IC2.36(PA2) IC3.30(MDIO) R31.2
RMII_RXD0: IC2.44(PC4) IC3.43(RXD_0)
RMII_RXD1: IC2.45(PC5) IC3.44(RXD_1)
RMII_TX_EN: IC2.70(PB11) IC3.2(TX_EN)
RMII_TXD0: IC2.73(PB12) IC3.3(TXD_0)
RMII_TXD1: IC2.74(PB13) IC3.4(TXD_1)
RX_N [diff pair]: J1.6(RX-) T1.9(RX-)
RX_P [diff pair]: J1.3(RX+) T1.11(RX+)
SPI_MISO: IC2.112(PC11) R71.2
SPI_MOSI: IC2.113(PC12) R62.1
SPI_SCK: IC2.111(PC10) R63.1
SWCLK: IC2.109(PA14) SV1.6
SWDIO: IC2.105(PA13) SV1.2
SWO: IC2.133(PB3) SV1.5
TD_N [diff pair]: D1.1(I/O1) IC3.16(TD-) R38.1 R43.1
TD_P [diff pair]: D1.6(I/O4) IC3.17(TD+) R37.1 R41.1
TX_N [diff pair]: J1.2(TX-) T1.14(TX-)
TX_P [diff pair]: J1.1(TX+) T1.16(TX+)
VBAT: C30.1 G1.+ IC2.6(VBAT)
VDDA: C32.1 IC2.32(VREF+) IC2.33(VDDA) L1.1 ; supply symbol labelled AVDD
Unconnected: IC2.4(PE5) IC2.5(PE6) IC2.7(PC13) IC2.10(PF0) IC2.11(PF1) IC2.12(PF2) IC2.13(PF3) IC2.14(PF4) IC2.15(PF5) IC2.21(PF9) IC2.22(PF10) IC2.26(PC0) IC2.28(PC2) IC2.29(PC3) IC2.34(PA0) IC2.35(PA1) IC2.37(PA3) IC2.40(PA4) IC2.41(PA5) IC2.42(PA6) IC2.46(PB0) IC2.47(PB1) IC2.48(PB2) IC2.49(PF11) IC2.50(PF12) IC2.53(PF13) IC2.58(PE7) IC2.59(PE8) IC2.60(PE9) IC2.63(PE10) IC2.64(PE11) IC2.69(PB10) IC2.81(PD12) IC2.82(PD13) IC2.85(PD14) IC2.86(PD15) IC2.87(PG2) IC2.91(PG6) IC2.92(PG7) IC2.93(PG8) IC2.96(PC6) IC2.97(PC7) IC2.103(PA11) IC2.104(PA12) IC2.110(PA15) IC2.114(PD0) IC2.115(PD1) IC2.116(PD2) IC2.117(PD3) IC2.118(PD4) IC2.119(PD5) IC2.122(PD6) IC2.123(PD7) IC2.124(PG9) IC2.125(PG10) IC2.126(PG11) IC2.127(PG12) IC2.128(PG13) IC2.129(PG14) IC2.132(PG15) IC2.138(BOOT0) IC3.1(TX_CLK) IC3.5(TXD_2) IC3.7(PWR_DOWN) IC3.8(TCK) IC3.9(TDO) IC3.10(TMS) IC3.11(TRST_N) IC3.12(TDI) IC3.25(CLK_OUT) IC3.33(X2) IC3.38(RX_CLK) IC3.41(RX_ER) IC3.42(COL) IC3.45(RXD_2) IC3.46(RXD_3) IC4.4(SS) IC4.7(/RST) IC4.8(MODE) IC5.4(SS) IC5.7(/RST) IC5.8(MODE) OS1.1(CON) Q3.2(IN2) Q3.4(IN4) Q3.6(IN6) Q3.8(IN8) Q3.11(OUT8) Q3.13(OUT6) Q3.15(OUT4) Q3.17(OUT2) Q4.2(IN2) Q4.4(IN4) Q4.6(IN6) Q4.8(IN8) Q4.11(OUT8) Q4.13(OUT6) Q4.15(OUT4) Q4.17(OUT2) SV1.9 SV1.10

## Notes on the sheet
- Sygnalizacja zasilania + statusu
- Do zweryfikowania jasność świecenia
  (na etapie testowania prototypu)
- 1mA
  @3V3
- 1mA
  @3V3
- 1mA
  @24V
- Złącze wyjściowe
  na moduły SPI + CS
- Złącze
  programujące
- Złącze zasilające
  + DMX
- Do zweryfikowania wartości rezystorów - opcjonalnie podłączenie kondensatorów.
  "Resistor array" zamiast pojedynczych
- Szybkie wejścia HSC
- Digital Input 24V | Ethernet
- Decaps
- Mikrokontroler i peryferia | Mikrokontroler i peryferia
- Opcjonalnie, kondensatory używane w przypadku HSC
  - do modyfikacji wraz z dopasowaną wersją izolatora wejść
- Digital Output 5-24V
- Sygnalizacja stanu wyjść

## Library data of the parts
C1-C8 = rcl:C-EU: CAPACITOR, European symbol; MF: AVX; MPN: 06035C222JAT2A; SPICEPREFIX: C
C9 C16-C24 C26 C28 C29 C31-C35 C37-C43 C46 C47 = rcl:C-EU: CAPACITOR, European symbol; MF: AVX; MPN: 06033C104KAT2A; SPICEPREFIX: C
C10 C30 = rcl:C-EU: CAPACITOR, European symbol; MF: AVX; MPN: 0603YC105KAT4A; SPICEPREFIX: C
C11 C12 = rcl:C-EU: CAPACITOR, European symbol; MF: AVX; MPN: 06035A100JAT2A; SPICEPREFIX: C
C13 C14 = rcl:C-EU: CAPACITOR, European symbol; MF: AVX; MPN: 06035A220JAT2A; SPICEPREFIX: C
C15 = rcl:C-EU: CAPACITOR, European symbol; MF: AVX; MPN: 0603ZD475KAT2A; SPICEPREFIX: C
C25 C27 = rcl:C-EU: CAPACITOR, European symbol; MF: AVX; MPN: 06036C225KAT2A; SPICEPREFIX: C
C36 = rcl:CPOL-EU: POLARIZED CAPACITOR, European symbol; MF: AVX; MPN: F931A106MAA; SPICEPREFIX: C
C44 C45 = rcl:C-EU: CAPACITOR, European symbol; MF: Vishay; MPN: VJ1206Y102MXFAT4X; SPICEPREFIX: C
C48 C51 = rcl:C-EU: CAPACITOR, European symbol; MF: AVX; MPN: 0603ZC224KAT9A; SPICEPREFIX: C
C49 C52 = rcl:C-EU: CAPACITOR, European symbol; MF: AVX; MPN: 12065C105M4Z2A; SPICEPREFIX: C
C50 C53 = rcl:C-EU: CAPACITOR, European symbol; MF: AVX; MPN: 12066G106ZAT4A; SPICEPREFIX: C
D1 = fx_workspace:USBLC6-4SC6; MF: ST-MICROELECTRONICS; MPN: USBLC6-4SC6
G1 = wlasne:CH25-2032LF: Podstawka - bateria pastylka Producent COMF Typ akcesoriów do baterii podstawka Rozmiar ogniwa 2032, BR2032, CR2032 Ilość baterii 1; MF: G1; MPN: CH25-2032
IC1 = wlasne:SI838X; MF: Silicon Labs; MPN: SI8382P-IU
IC2 = SVS:STM32F429ZI; MF: STMicroelectronics; MPN: STM32F429ZIT6
IC3 = fx_workspace:DP83848: PHYTER® - Extended Temperature Single Port 10/100 Mb/s Ethernet Physical Layer Transceiver Auto generated by make-symbol-device-package-bsdl.ulp Rev. 34 Source: dp83848yb.bsdl http://www.national.com/ds/DP/DP83848VYB.pdf; MF: Texas Instruments; MPN: DP83848CVV/NOPB; OC_FARNELL: 1286817; OC_NEWARK: 11N4484
IC4 IC5 = fx_workspace:MAX17552; MF: Maxim; MPN: MAX17552AUB+
J1 = fx_workspace:RJHSE-5381: RJ-45 with LEDs; MF: AMPHENOL; MPN: RJHSE-5381
JP1 = pinhead:PINHD-2X6: PIN HEADER; MF: NINIGI; MPN: ZL2019-40
JP2 = pinhead:PINHD-2X12: PIN HEADER; MF: NINIGI; MPN: ZL2019-40
JP3 = pinhead:PINHD-1X2: PIN HEADER; MF: CONNFLY; MPN: DS1021-1*20SF1-5
L1 = rc-master-smd:FB_: FERRITE BEAD; MF: TDK; MPN: MMZ1608S601ATD25
L2 L3 = wlasne:SRR4528A: SRR4528A Manufacturer: Bourns Product Category: Fixed Inductors RoHS: Details Termination Style: SMD/SMT Shielding: Shielded Inductance: 220 uH Tolerance: 20 % Maximum DC Current: 370 mA Maximum DC Resistance: 1480 Ohms Minimum Operating Temperature: - 40 C Maximum Operating Temperature: + 125 C Test Frequency: 100 kHz Termination: - Mounting Style: PCB Mount Length: 5 mm Width: 5 mm Height: 2.8 mm Application: Power Qualification: AEC-Q200 Series: SRR4528A Packaging: Cut Tape Packaging: MouseReel Packaging: Reel Core Material: Ferrite Product: Fixed Inductors Self Resonant Frequency: 6 MHz Brand: Bourns Product Type: Shielded Power Inductors Factory Pack Quantity: 500 Subcategory: Inductors, Chokes & Coils; MF: Bourns; MPN: SRR4528A-221M
LED1-LED8 LED12-LED19 = led:LED: LED OSRAM: - CHIPLED LG R971, LG N971, LY N971, LG Q971, LY Q971, LO R971, LY R971 LH N974, LH R974 LS Q976, LO Q976, LY Q976 LO Q996 - Hyper CHIPLED LW Q18S LB Q993, LB Q99A, LB R99A - SideLED LS A670, LO A670, LY A670, LG A670, LP A670 LB A673, LV A673, LT A673, LW A673 LH A674 LY A675 LS A676, LA A676, LO A676, LY A676, LW A676 LS A679, LY A679, LG A679 - Hyper Micro SIDELED® LS Y876, LA Y876, LO Y876, LY Y876 LT Y87S - SmartLED LW L88C, LW L88S LB L89C, LB L89S, LG L890 LS L89K, LO L89K, LY L89K LS L896, LA L896, LO L896, LY L896 - TOPLED LS T670, LO T670, LY T670, LG T670, LP T670 LSG T670, LSP T670, LSY T670, LOP T670, LYG T670 LG T671, LOG T671, LSG T671 LB T673, LV T673, LT T673, LW T673 LH T674 LS T676, LA T676, LO T676, LY T676, LB T676, LH T676, LSB T676, LW T676 LB T67C, LV T67C, LT T67C, LS T67K, LO T67K, LY T67K, LW E67C LS E67B, LA E67B, LO E67B, LY E67B, LB E67C, LV E67C, LT E67C LW T67C LS T679, LY T679, LG T679 LS T770, LO T770, LY T770, LG T770, LP T770 LB T773, LV T773, LT T773, LW T773 LH T774 LS E675, LA E675, LY E675, LS T675 LS T776, LA T776, LO T776, LY T776, LB T776 LHGB T686 LT T68C, LB T68C - Hyper Mini TOPLED® LB M676 - Mini TOPLED Santana® LG M470 LS M47K, LO M47K, LY M47K Source: http://www.osram.convergy.de LUXEON: - LUMILED® LXK2-PW12-R00, LXK2-PW12-S00, LXK2-PW14-U00, LXK2-PW14-V00 LXK2-PM12-R00, LXK2-PM12-S00, LXK2-PM14-U00 LXK2-PE12-Q00, LXK2-PE12-R00, LXK2-PE12-S00, LXK2-PE14-T00, LXK2-PE14-U00 LXK2-PB12-K00, LXK2-PB12-L00, LXK2-PB12-M00, LXK2-PB14-N00, LXK2-PB14-P00, LXK2-PB14-Q00 LXK2-PR12-L00, LXK2-PR12-M00, LXK2-PR14-Q00, LXK2-PR14-R00 LXK2-PD12-Q00, LXK2-PD12-R00, LXK2-PD12-S00 LXK2-PH12-R00, LXK2-PH12-S00 LXK2-PL12-P00, LXK2-PL12-Q00, LXK2-PL12-R00 Source: www.luxeon.com KINGBRIGHT: KA-3528ASYC Source: www.kingbright.com; MF: Kingbright; MPN: APTD1608LCGCK
LED9 LED10 = led:LED: LED OSRAM: - CHIPLED LG R971, LG N971, LY N971, LG Q971, LY Q971, LO R971, LY R971 LH N974, LH R974 LS Q976, LO Q976, LY Q976 LO Q996 - Hyper CHIPLED LW Q18S LB Q993, LB Q99A, LB R99A - SideLED LS A670, LO A670, LY A670, LG A670, LP A670 LB A673, LV A673, LT A673, LW A673 LH A674 LY A675 LS A676, LA A676, LO A676, LY A676, LW A676 LS A679, LY A679, LG A679 - Hyper Micro SIDELED® LS Y876, LA Y876, LO Y876, LY Y876 LT Y87S - SmartLED LW L88C, LW L88S LB L89C, LB L89S, LG L890 LS L89K, LO L89K, LY L89K LS L896, LA L896, LO L896, LY L896 - TOPLED LS T670, LO T670, LY T670, LG T670, LP T670 LSG T670, LSP T670, LSY T670, LOP T670, LYG T670 LG T671, LOG T671, LSG T671 LB T673, LV T673, LT T673, LW T673 LH T674 LS T676, LA T676, LO T676, LY T676, LB T676, LH T676, LSB T676, LW T676 LB T67C, LV T67C, LT T67C, LS T67K, LO T67K, LY T67K, LW E67C LS E67B, LA E67B, LO E67B, LY E67B, LB E67C, LV E67C, LT E67C LW T67C LS T679, LY T679, LG T679 LS T770, LO T770, LY T770, LG T770, LP T770 LB T773, LV T773, LT T773, LW T773 LH T774 LS E675, LA E675, LY E675, LS T675 LS T776, LA T776, LO T776, LY T776, LB T776 LHGB T686 LT T68C, LB T68C - Hyper Mini TOPLED® LB M676 - Mini TOPLED Santana® LG M470 LS M47K, LO M47K, LY M47K Source: http://www.osram.convergy.de LUXEON: - LUMILED® LXK2-PW12-R00, LXK2-PW12-S00, LXK2-PW14-U00, LXK2-PW14-V00 LXK2-PM12-R00, LXK2-PM12-S00, LXK2-PM14-U00 LXK2-PE12-Q00, LXK2-PE12-R00, LXK2-PE12-S00, LXK2-PE14-T00, LXK2-PE14-U00 LXK2-PB12-K00, LXK2-PB12-L00, LXK2-PB12-M00, LXK2-PB14-N00, LXK2-PB14-P00, LXK2-PB14-Q00 LXK2-PR12-L00, LXK2-PR12-M00, LXK2-PR14-Q00, LXK2-PR14-R00 LXK2-PD12-Q00, LXK2-PD12-R00, LXK2-PD12-S00 LXK2-PH12-R00, LXK2-PH12-S00 LXK2-PL12-P00, LXK2-PL12-Q00, LXK2-PL12-R00 Source: www.luxeon.com KINGBRIGHT: KA-3528ASYC Source: www.kingbright.com; MF: Kingbright; MPN: APTD1608LSURCK
LED11 = SVS:APHF1608SEEQBDZGKC: APHF1608SEEQBDZGKC Manufacturer: Kingbright Product Category: Standard LEDs - SMD RoHS: Details Product: RGB LEDs Package/Case: 0603 (1608 metric) Orientation: Top View Illumination Colour: RGB Wavelength/Colour Temperature: 621 nm, 525 nm, 465 nm Luminous Intensity: 120 mcd, 480 mcd, 60 mcd Viewing Angle: 140 deg Lens Colour/Style: Water Clear If - Forward Current: 20 mA Vf - Forward Voltage: 2 V, 3.3 V, 3.3 V Length: 1.6 mm Height: 0.5 mm Width: 0.8 mm Minimum Operating Temperature: - 40 C Maximum Operating Temperature: + 85 C Packaging: Cut Tape Packaging: MouseReel Packaging: Reel Brand: Kingbright Mounting Style: SMD/SMT Moisture Sensitive: Yes Product Type: LED - Standard Factory Pack Quantity: 4000 Subcategory: LEDs; MF: Kingbright; MPN: APHF1608SEEQBDZGKC
OK1 OK2 = fx_workspace:HCPL0531: HEWLETT PACKARD OPTO COUPLER; MF: Broadcom / Avago; MPN: HCPL-0531-500E
OK3 = fx_workspace:TLP291-4; MF: Toshiba; MPN: TLP291-4(GB,E)
OS1 = fx_workspace:CFPS-39: OSCILLATOR WITH OE; MF: IQD; MPN: LFSPXO025560
Q1 = SVS:CRYSTAL: CRYSTAL; MF: ECS; MPN: ECS-.327-9-34QCS-TR
Q2 = SVS:CRYSTAL_SHIELD; MF: IQD; MPN: LFXTAL059158
Q3 Q4 = fx_workspace:MIC2981/82; MF: Microchip; MPN: MIC2981/82YWM
R1-R8 = rcl:R-EU_: RESISTOR, European symbol; MF: Yageo; MPN: RC1206JR-076K2L; SPICEPREFIX: R
R9-R16 = rcl:R-EU_: RESISTOR, European symbol; MF: Yageo; MPN: RC1206JR-072K4L; SPICEPREFIX: R
R17-R25 R27-R29 R54-R78 = rcl:R-EU_: RESISTOR, European symbol; MF: Yageo; MPN: RC0603FR-071K2L; SPICEPREFIX: R
R26 R112 R116 = rcl:R-EU_: RESISTOR, European symbol; MF: Yageo; MPN: AC0603FR-0722K1L; SPICEPREFIX: R
R30 R32 R33 R35 R36 R51 R53 = rcl:R-EU_: RESISTOR, European symbol; MF: Yageo; MPN: RC0603FR-072K2P; SPICEPREFIX: R
R31 = rcl:R-EU_: RESISTOR, European symbol; MF: Yageo; MPN: RC0603FR-071K5P; SPICEPREFIX: R
R34 = rcl:R-EU_: RESISTOR, European symbol; MF: Yageo; MPN: AC0603FR-074K87L; SPICEPREFIX: R
R37-R40 = rcl:R-EU_: RESISTOR, European symbol; MF: Bourns; MPN: CR0603-FX-49R9GLF; SPICEPREFIX: R
R41-R45 = rcl:R-EU_: RESISTOR, European symbol; MF: Yageo; MPN: RC0603JR-070RL; SPICEPREFIX: R
R46-R49 = rcl:R-EU_: RESISTOR, European symbol; MF: Yageo; MPN: RC0603JR-0775RL; SPICEPREFIX: R
R50 R52 = rcl:R-EU_: RESISTOR, European symbol; MF: Yageo; MPN: RC0603FR-07110RL; SPICEPREFIX: R
R79-R82 R103-R106 = rcl:R-EU_: RESISTOR, European symbol; MF: Yageo; MPN: AC0603FR-07300RL; SPICEPREFIX: R
R83-R86 R107-R110 = rcl:R-EU_: RESISTOR, European symbol; MF: Yageo; MPN: RC0603FR-07523RL; SPICEPREFIX: R
R87-R90 R95-R98 = rcl:R-EU_: RESISTOR, European symbol; MF: Bourns; MPN: CR0603-FX-2100ELF; SPICEPREFIX: R
R91-R94 R99-R102 = rcl:R-EU_: RESISTOR, European symbol; MF: Yageo; MPN: RC0603JR-072K7L; SPICEPREFIX: R
R111 R115 = rcl:R-EU_: RESISTOR, European symbol; MF: Yageo; MPN: AC0603FR-07191KL; SPICEPREFIX: R
R113 R117 = rcl:R-EU_: RESISTOR, European symbol; MF: Bourns; MPN: CR0603-FX-2613ELF; SPICEPREFIX: R
R114 R118 = rcl:R-EU_: RESISTOR, European symbol; MF: Vishay; MPN: CRCW060349K9FKEB; SPICEPREFIX: R
S1 = switch-tact:DTSM-6; MF: DIPTRONICS; MPN: DTSM-63N-V-B
SV1 = con-harting-ml:ML10: HARTING; MF: Wurth Electronics; MPN: 61201021621; OC_FARNELL: unknown; OC_NEWARK: unknown
T1 = fx_workspace:HX1188: Transformer- H110X, H1121, HX1188; MF: PULSE; MPN: H1102NL
X1-X11 = con-phoenix-508:MKDSN1,5/2-5,08: MKDSN 1,5/ 2-5,08 Printklemme Nennstrom: 13,5 A Nennspannung: 250 V Rastermaß: 5,08 mm Polzahl: 2 Anschlussart: Schraubanschluss Montage: Löten Anschlussrichtung Leiter/Platine: 0 ° Artikelnummer: 1729128 Source: http://eshop.phoenixcontact.com .. 1729128.pdf; MF: NINIGI; MPN: TB-5.08-P-2P/BL

## Net classes
0 default: width 0.254 mm
1 diff pair: width 0.254 mm, clearance 0.254 mm